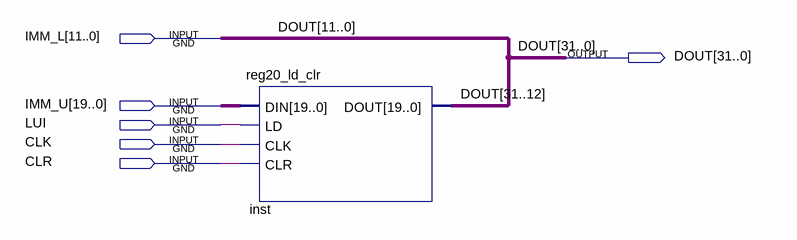
[diagram p0: schematic sheet]
// Quartus schematic regimm.bdf as structural Verilog: 1 symbols, 6 pins
module regimm (
  input  [11:0] IMM_L,
  input  [19:0] IMM_U,
  input  LUI,
  input  CLK,
  input  CLR,
  output [31:0] DOUT
);

  reg20_ld_clr inst (.DIN(IMM_U), .LD(LUI), .CLK(CLK), .CLR(CLR), .DOUT(DOUT[31:12]));

  assign DOUT[11:0] = IMM_L;
endmodule
